# Altium project Transmisor.PrjPcb
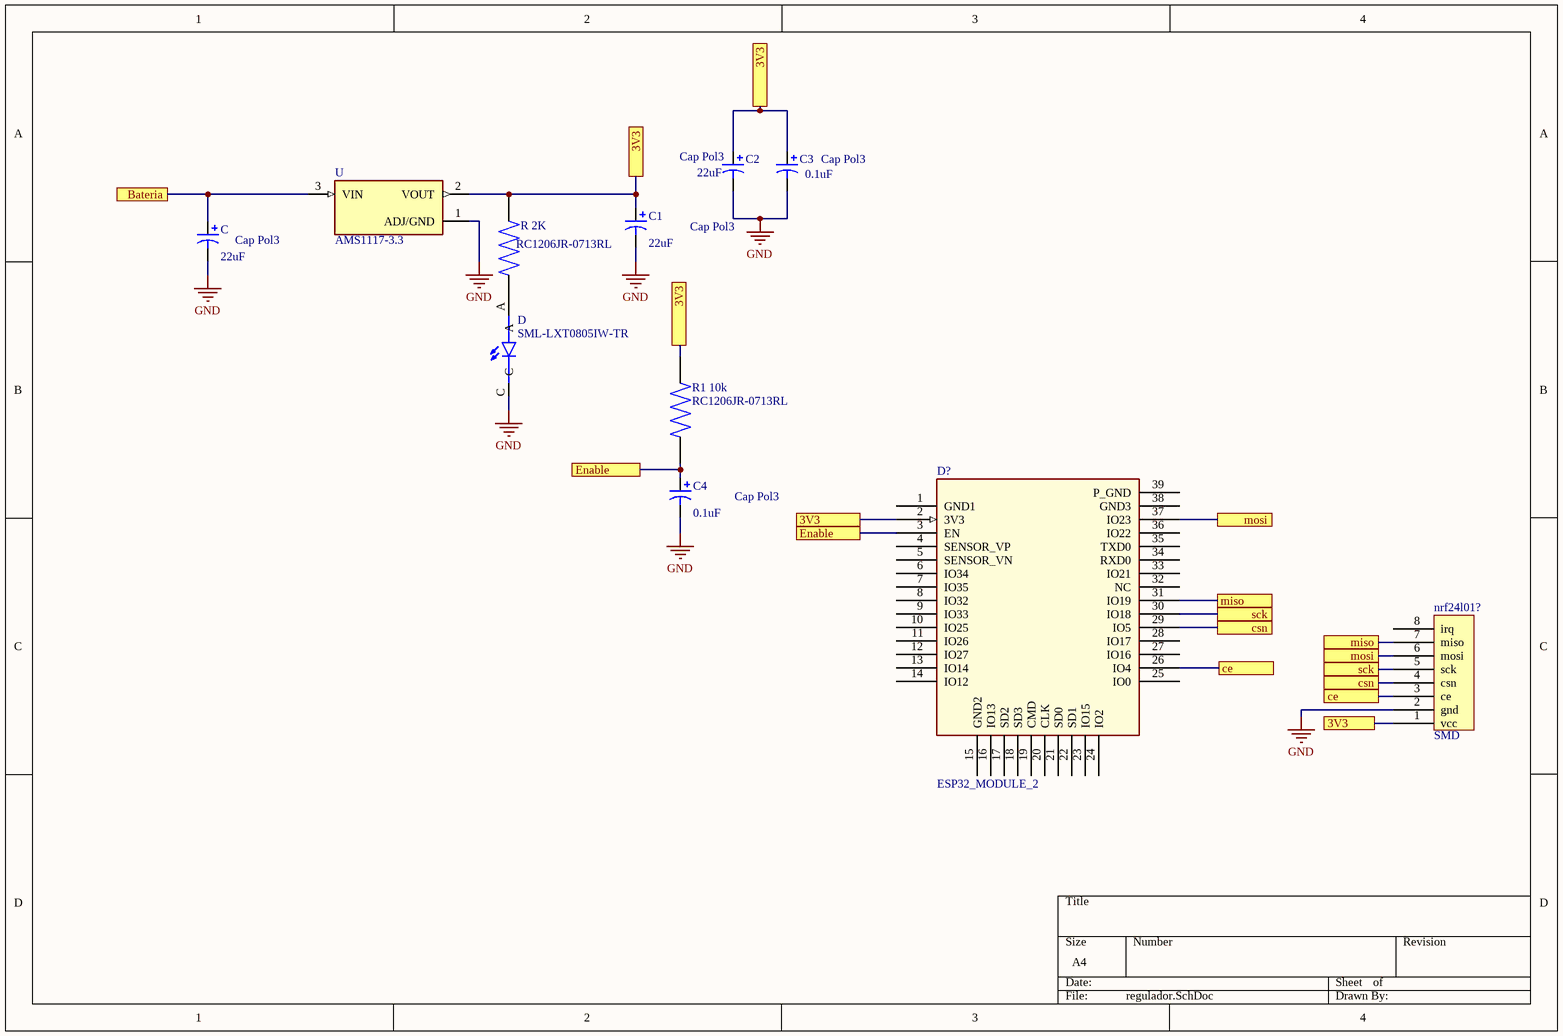
[diagram p0: regulador.SchDoc]
1 sheet, 11 parts. Net scope: flat (ports and power ports of the same name join across sheets).
Board file: regulador.PcbDoc

## Sheet regulador.SchDoc
size A4

### Parts
C  Cap Pol3  value 22uF  [C0805]
C1  Cap Pol3  value 22uF  [C0805]
C2  Cap Pol3  value 22uF  [C0805]
C3  Cap Pol3  value 0.1uF  [C0805]
C4  Cap Pol3  value 0.1uF  [C0805]
D  SML-LXT0805IW-TR  [LEDC2012X120N]
D?  ESP32_MODULE_2  [MODULE_ESP32-WROOM-32D]
nrf24l01?  SMD  [NRF24L01]
R1_10k  RC1206JR-0713RL  [RESC3116X65N]
R_2K  RC1206JR-0713RL  [RESC3116X65N]
U  AMS1117-3.3  [SOT229P700X180-4N]

### Ports
3V3, Bateria, ce, csn, Enable, miso, mosi, sck

### Nets
GND: C.2 C1.2 C2.2 C3.2 C4.2 D.C nrf24l01?.2(gnd) U.1(ADJ/GND)
NetC1_1: C1.1 C2.1 C3.1 D?.2(3V3) nrf24l01?.1(vcc) R1_10k.2 R_2K.2 U.2(VOUT) ; port 3V3
NetC4_1: C4.1 D?.3(EN) R1_10k.1 ; port Enable
NetC_1: C.1 U.3(VIN) ; port Bateria
NetD?_26: D?.26(IO4) nrf24l01?.3(ce) ; port ce
NetD?_29: D?.29(IO5) nrf24l01?.4(csn) ; port csn
NetD?_30: D?.30(IO18) nrf24l01?.5(sck) ; port sck
NetD?_31: D?.31(IO19) nrf24l01?.7(miso) ; port miso
NetD?_37: D?.37(IO23) nrf24l01?.6(mosi) ; port mosi
NetD_A: D.A R_2K.1

Not connected (* = marked no-connect by the designer): D? 1(GND1) 4(SENSOR_VP) 5(SENSOR_VN) 6(IO34) 7(IO35) 8(IO32) 9(IO33) 10(IO25) 11(IO26) 12(IO27) 13(IO14) 14(IO12) 15(GND2) 16(IO13) 17(SD2) 18(SD3) 19(CMD) 20(CLK) 21(SD0) 22(SD1) 23(IO15) 24(IO2) 25(IO0) 27(IO16) 28(IO17) 32(NC) 33(IO21) 34(RXD0) 35(TXD0) 36(IO22) 38(GND3) 39(P_GND); nrf24l01? 8(irq)

### Library data of the parts
C C1-C4 = Cap Pol3: Polarized Capacitor (Surface Mount); Published: 8-Jun-2000; LatestRevisionDate: 29-May-2009; LatestRevisionNote: IPC-7351 Footprint Added.; PackageReference: C0805; Publisher: Altium Limited; PackageDescription: Chip Capacitor
D = SML-LXT0805IW-TR: Red LED Indication - Discrete 2V 0805 _2012 Metric_; MF: Lumex Opto/Components; Value: *; Package: 0805 Lumex; Price: None; MP: SML-LXT0805IW-TR; Availability: Unavailable; SnapEDA_Link: https://www.snapeda.com/parts/SML-LXT0805IW-TR/Lumex%20Opto/Components%20Inc./view-part/340416/?ref=snap
nrf24l01? = nrf24l01_smd
R1_10k R_2K = RC1206JR-0713RL: 13 Ohms Â±5% 0.25W, 1/4W Chip Resistor 1206 _3216 Metric_ Moisture Resistant Thick Film; MF: Yageo; MP: RC1206JR-0713RL; Availability: Unavailable; SnapEDA_Link: https://www.snapeda.com/parts/RC1206JR-0713RL/Yageo/view-part/105893/?ref=snap; Package: 3116 Yageo; Value: *; Price: None
U = AMS1117-3.3: Sot223/Pkg 1-Amp 3.3-Volt Low Drop Out Voltage Regulatator; MF: Advanced Monolithic Systems; Price: None; Package: None; Value: *; MP: AMS1117-3.3; Availability: Unavailable; SnapEDA_Link: https://www.snapeda.com/parts/AMS1117-3.3/Advanced%20Monolithic%20Systems/view-part/53450/?ref=snap